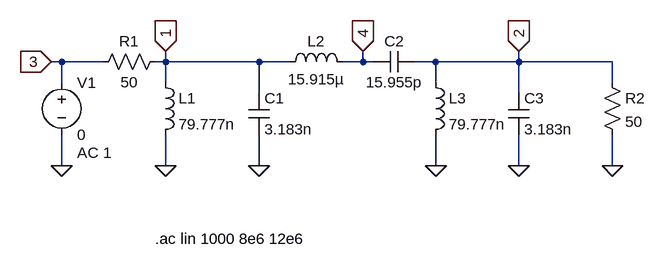
[diagram p0: schematic Two port circuit BPF.asc]
Two port circuit BPF.asc, the LTspice schematic file:
Version 4
SHEET 1 880 680
WIRE -480 48 -496 48
WIRE -416 48 -480 48
WIRE -320 48 -320 32
WIRE -320 48 -336 48
WIRE -176 48 -320 48
WIRE -128 48 -176 48
WIRE -16 48 -16 32
WIRE -16 48 -48 48
WIRE 0 48 -16 48
WIRE 96 48 64 48
WIRE 224 48 224 32
WIRE 224 48 96 48
WIRE 368 48 224 48
WIRE -480 80 -480 48
WIRE -320 80 -320 48
WIRE 96 80 96 48
WIRE 368 80 368 48
WIRE -176 96 -176 48
WIRE 224 96 224 48
WIRE -480 208 -480 160
WIRE -320 208 -320 160
WIRE -176 208 -176 160
WIRE 96 208 96 160
WIRE 224 208 224 160
WIRE 368 208 368 160
FLAG -480 208 0
FLAG -16 32 4
IOPIN -16 32 In
FLAG -320 32 1
IOPIN -320 32 In
FLAG 224 32 2
IOPIN 224 32 In
FLAG -496 48 3
IOPIN -496 48 In
FLAG 96 208 0
FLAG 224 208 0
FLAG 368 208 0
FLAG -320 208 0
FLAG -176 208 0
SYMBOL voltage -480 64 R0
WINDOW 123 24 124 Left 2
WINDOW 39 0 0 Left 2
SYMATTR Value2 AC 1
SYMATTR InstName V1
SYMATTR Value 0
SYMBOL res -432 64 R270
WINDOW 0 32 56 VTop 2
WINDOW 3 0 56 VBottom 2
SYMATTR InstName R1
SYMATTR Value 50
SYMBOL res 352 64 R0
SYMATTR InstName R2
SYMATTR Value 50
SYMBOL cap -192 96 R0
SYMATTR InstName C1
SYMATTR Value 3.183n
SYMBOL cap 0 64 R270
WINDOW 0 32 32 VTop 2
WINDOW 3 0 32 VBottom 2
SYMATTR InstName C2
SYMATTR Value 15.955p
SYMBOL ind -336 64 R0
SYMATTR InstName L1
SYMATTR Value 79.777n
SYMBOL ind -144 64 R270
WINDOW 0 32 56 VTop 2
WINDOW 3 5 56 VBottom 2
SYMATTR InstName L2
SYMATTR Value 15.915µ
SYMBOL ind 80 64 R0
SYMATTR InstName L3
SYMATTR Value 79.777n
SYMBOL cap 208 96 R0
SYMATTR InstName C3
SYMATTR Value 3.183n
TEXT -336 320 Left 2 !.ac lin 1000 8e6 12e6

The netlist it stands for:
* Two port circuit BPF.asc
V1 3 0 0 AC 1
R1 3 1 50
R2 2 0 50
C1 1 0 3.183n
C2 4 2 15.955p
L1 1 0 79.777n
L2 1 4 15.915µ
L3 2 0 79.777n
C3 2 0 3.183n
.ac lin 1000 8e6 12e6
.backanno
.end